# Altium schematic sheet main.SchDoc
size A4; SheetNumber: 1; SheetTotal: 4
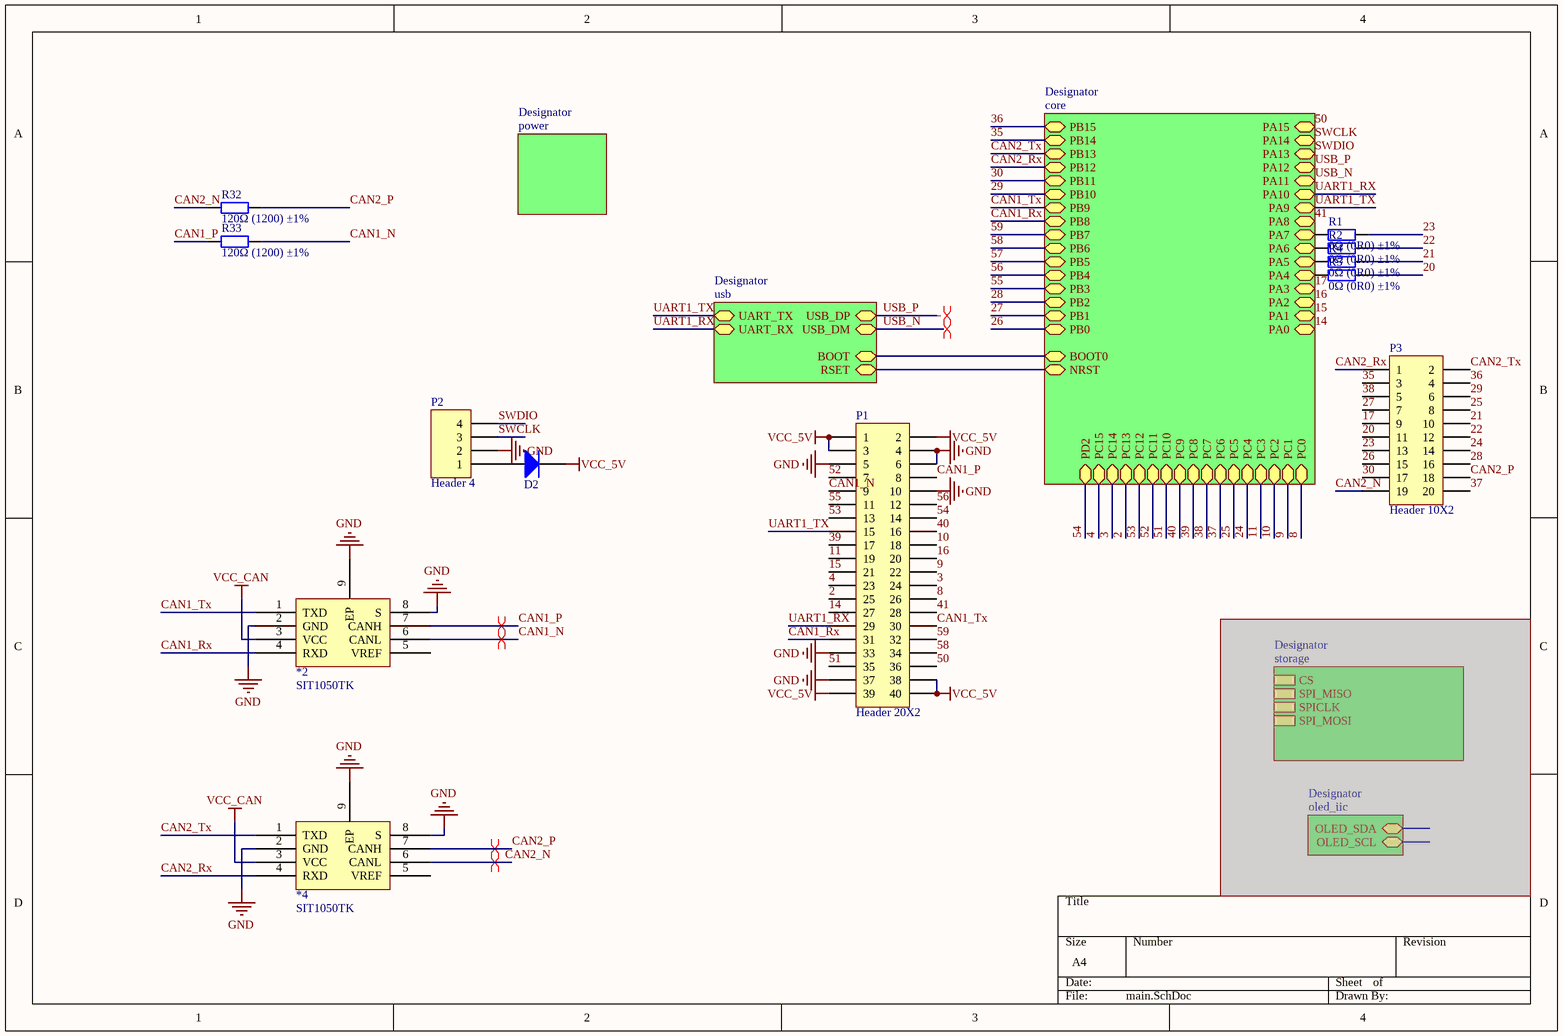
[diagram p0: main.SchDoc]

## Parts
*2  SIT1050TK  [DFN3x3-8]
*4  SIT1050TK  [DFN3x3-8]
D2  二极管-5819W  [SOD-323]  (value not drawn)
P1  Header 20X2  [HEADER_0.8mm_2x20P_G]
P2  Header 4  [HDR1X4]
P3  Header 10X2  [HEAER_0.8mm_2x10P_M]
R1  0Ω (0R0) ±1%  [LC-0402_R]
R2  0Ω (0R0) ±1%  [LC-0402_R]
R4  0Ω (0R0) ±1%  [LC-0402_R]
R5  0Ω (0R0) ±1%  [LC-0402_R]
R32  120Ω (1200) ±1%  [LC-0402_R]
R33  120Ω (1200) ±1%  [LC-0402_R]

## Sub-sheets
Designator = core: PB15 (bidir), PB14 (bidir), PB13 (bidir), PB12 (bidir), PB11 (bidir), PB10 (bidir), PB9 (bidir), PB8 (bidir), PB7 (bidir), PB6 (bidir), PB5 (bidir), PB4 (bidir), PB3 (bidir), PB2 (bidir), PB1 (bidir), PB0 (bidir), PA15 (bidir), PA14 (bidir), PA13 (bidir), PA12 (bidir), PA11 (bidir), PA10 (bidir), PA9 (bidir), PA8 (bidir), PA7 (bidir), PA6 (bidir), PA5 (bidir), PA4 (bidir), PA3 (bidir), PA2 (bidir), PA1 (bidir), PA0 (bidir), PD2 (bidir), PC15 (bidir), PC14 (bidir), PC13 (bidir), PC12 (bidir), PC11 (bidir), PC10 (bidir), PC9 (bidir), PC8 (bidir), PC7 (bidir), PC6 (bidir), PC5 (bidir), PC4 (bidir), PC3 (bidir), PC2 (bidir), PC1 (bidir), PC0 (bidir), BOOT0 (bidir), NRST (bidir)
Designator = storage (masked out): CS, SPI_MISO, SPICLK, SPI_MOSI
Designator = usb: UART_TX (bidir), UART_RX (bidir), USB_DP (bidir), USB_DM (bidir), BOOT (bidir), RSET (bidir)
Designator = power: no entries
Designator = oled_iic (masked out): OLED_SDA (bidir), OLED_SCL (bidir)

## Nets
GND: *2.2(GND) *2.8(S) *2.9(EP) *4.2(GND) *4.8(S) *4.9(EP) P1.4 P1.5 P1.6 P1.10 P1.33 P1.37 P2.2
VCC_5V: D2.2(K) P1.1 P1.2 P1.3 P1.38 P1.39 P1.40
VCC_CAN: *2.3(VCC) *4.3(VCC)
2: P1.25 ; sheet Designator/PC13
3: P1.24 ; sheet Designator/PC14
4: P1.23 ; sheet Designator/PC15
8: P1.26 ; sheet Designator/PC0
9: P1.22 ; sheet Designator/PC1
10: P1.18 ; sheet Designator/PC2
11: P1.19 ; sheet Designator/PC3
14: P1.27 ; sheet Designator/PA0
15: P1.21 ; sheet Designator/PA1
16: P1.20 ; sheet Designator/PA2
17: P3.9 ; sheet Designator/PA3
20: P3.11 R5.2
21: P3.10 R4.2
22: P3.12 R2.2
23: P3.13 R1.2
24: P3.14 ; sheet Designator/PC4
25: P3.8 ; sheet Designator/PC5
26: P3.15 ; sheet Designator/PB0
27: P3.7 ; sheet Designator/PB1
28: P3.16 ; sheet Designator/PB2
29: P3.6 ; sheet Designator/PB10
30: P3.17 ; sheet Designator/PB11
35: P3.3 ; sheet Designator/PB14
36: P3.4 ; sheet Designator/PB15
37: P3.20 ; sheet Designator/PC6
38: P3.5 ; sheet Designator/PC7
39: P1.17 ; sheet Designator/PC8
40: P1.16 ; sheet Designator/PC9
41: P1.28 ; sheet Designator/PA8
50: P1.36 ; sheet Designator/PA15
51: P1.35 ; sheet Designator/PC10
52: P1.7 ; sheet Designator/PC11
53: P1.13 ; sheet Designator/PC12
54: P1.14 ; sheet Designator/PD2
55: P1.11 ; sheet Designator/PB3
56: P1.12 ; sheet Designator/PB4
57: sheet Designator/PB5
58: P1.34 ; sheet Designator/PB6
59: P1.32 ; sheet Designator/PB7
CAN1_N: *2.6(CANL) P1.9 R33.2
CAN1_P: *2.7(CANH) P1.8 R33.1
CAN1_Rx: *2.4(RXD) P1.31 ; sheet Designator/PB8
CAN1_Tx: *2.1(TXD) P1.30 ; sheet Designator/PB9
CAN2_N: *4.6(CANL) P3.19 R32.1
CAN2_P: *4.7(CANH) P3.18 R32.2
CAN2_Rx: *4.4(RXD) P3.1 ; sheet Designator/PB12
CAN2_Tx: *4.1(TXD) P3.2 ; sheet Designator/PB13
SWCLK: P2.3 ; sheet Designator/PA14
SWDIO: P2.4 ; sheet Designator/PA13
UART1_RX: P1.29 ; sheet Designator/PA10, sheet Designator/UART_RX
UART1_TX: P1.15 ; sheet Designator/PA9, sheet Designator/UART_TX
USB_N: sheet Designator/PA11, sheet Designator/USB_DM
USB_P: sheet Designator/PA12, sheet Designator/USB_DP
NetD2_1: D2.1(A) P2.1
NetR1_1: R1.1 ; sheet Designator/PA7
NetR2_1: R2.1 ; sheet Designator/PA6
NetR4_1: R4.1 ; sheet Designator/PA5
NetR5_1: R5.1 ; sheet Designator/PA4
(unnamed): sheet Designator/BOOT0, sheet Designator/BOOT
(unnamed): sheet Designator/NRST, sheet Designator/RSET

Not connected (* = marked no-connect by the designer): *2 5(VREF); *4 5(VREF)

## Layout directives
differential pair: CAN1_N, CAN1_P, CAN2_N, CAN2_P, USB_N, USB_P

## Library data of the parts
D2 = 二极管-5819W: 40V
P1 = Header 20X2: Header, 20-Pin, Dual row; LatestRevisionDate: 17-Jul-2002; LatestRevisionNote: Re-released for DXP Platform.; Publisher: Altium Limited
P2 = Header 4: Header, 4-Pin; LatestRevisionDate: 17-Jul-2002; LatestRevisionNote: Re-released for DXP Platform.; Publisher: Altium Limited
P3 = Header 10X2: Header, 10-Pin, Dual row; LatestRevisionDate: 17-Jul-2002; LatestRevisionNote: Re-released for DXP Platform.; Publisher: Altium Limited
R1 R2 R4 R5 = 0402 0Ω (0R0) 1%: 贴片电阻; ComponentLink1Description: 供应商链接; ComponentLink1URL: http://www.szlcsc.com/product/details_17853.html; Package: 0402; Supplier: LC; SuppliersPartNumber: C17168
R32 R33 = 0402 120Ω (1200) 1%: 贴片电阻; ComponentLink1Description: 供应商链接; ComponentLink1URL: http://www.szlcsc.com/product/details_25822.html; Package: 0402; Supplier: LC; SuppliersPartNumber: C25079